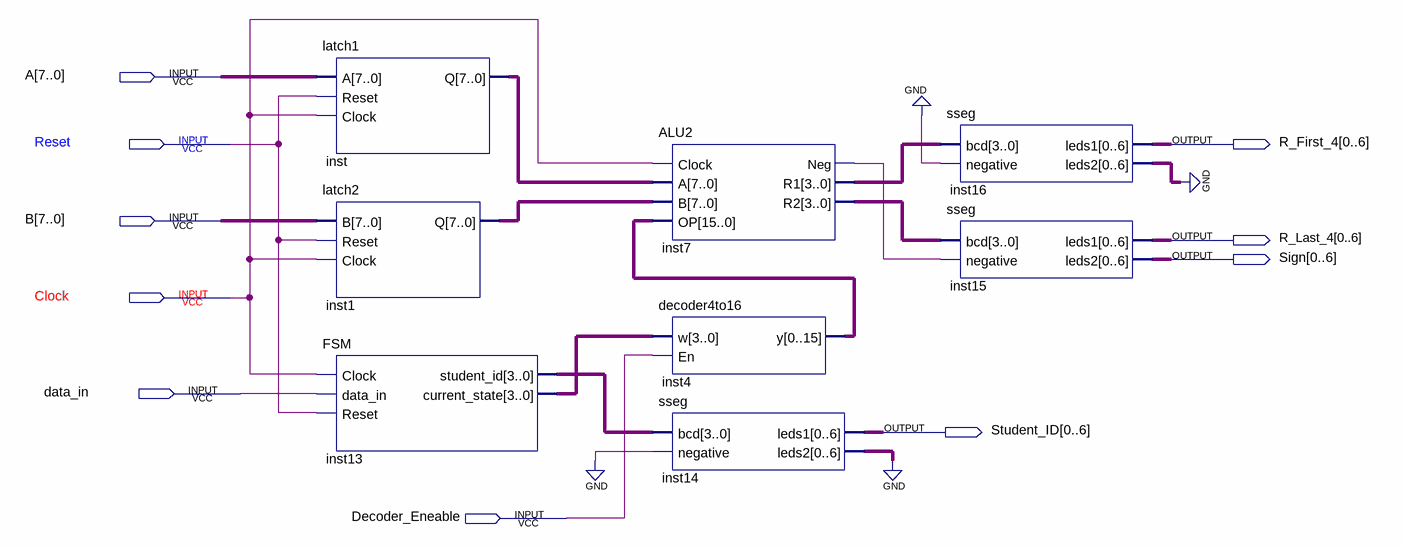
[diagram p0: schematic sheet]
// Quartus schematic Problem2.bdf as structural Verilog: 8 symbols, 10 pins
module Problem2 (
  input  [7:0] A,
  input  Reset,
  input  [7:0] B,
  input  Clock,
  input  data_in,
  input  Decoder_Eneable,
  output [0:6] R_First_4,
  output [0:6] R_Last_4,
  output [0:6] Sign,
  output [0:6] Student_ID
);

  wire inst7_neg;
  wire [3:0] inst7_r1, inst7_r2, inst13_current_state, inst13_student_id;
  wire [6:0] inst14_leds2, inst16_leds2;
  wire [7:0] inst1_q, inst_q;
  wire [15:0] inst4_y;

  latch1 inst (.A(A), .Reset(Reset), .Clock(Clock), .Q(inst_q));
  latch2 inst1 (.B(B), .Reset(Reset), .Clock(Clock), .Q(inst1_q));
  FSM inst13 (
    .Clock(Clock), .data_in(data_in), .Reset(Reset), .student_id(inst13_student_id),
    .current_state(inst13_current_state));
  ALU2 inst7 (.Clock(Clock), .A(inst_q), .B(inst1_q), .OP(inst4_y), .Neg(inst7_neg), .R1(inst7_r1), .R2(inst7_r2));
  decoder4to16 inst4 (.w(inst13_current_state), .En(Decoder_Eneable), .y(inst4_y));
  sseg inst14 (.bcd(inst13_student_id), .negative(1'b0), .leds1(Student_ID), .leds2(inst14_leds2));
  sseg inst16 (.bcd(inst7_r1), .negative(1'b0), .leds1(R_First_4), .leds2(inst16_leds2));
  sseg inst15 (.bcd(inst7_r2), .negative(inst7_neg), .leds1(R_Last_4), .leds2(Sign));
  // also tied to GND on the sheet: {inst14_leds2[0], inst14_leds2[1], inst14_leds2[2], inst14_leds2[3], inst14_leds2[4], inst14_leds2[5], inst14_leds2[6], inst16_leds2[0], inst16_leds2[1], inst16_leds2[2], inst16_leds2[3], inst16_leds2[4], inst16_leds2[5], inst16_leds2[6]}
endmodule
